# Altium schematic sheet ProximitySensor.SchDoc
size A
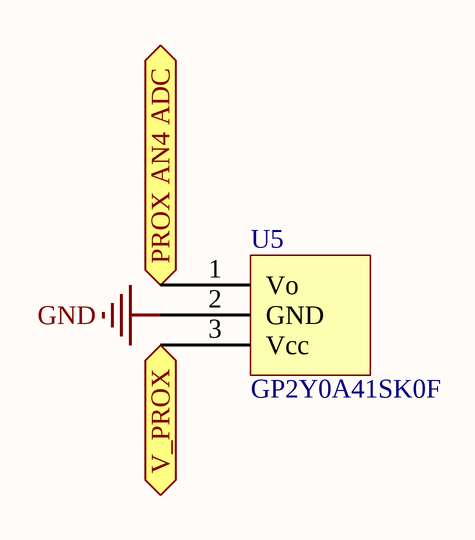
[diagram p0: ProximitySensor.SchDoc]

## Parts
U5  GP2Y0A41SK0F  [Proximity2]

## Ports
PROX AN4 ADC, V_PROX

## Nets
GND: U5.2(GND)
PROX AN4 ADC: U5.1(Vo) ; port PROX AN4 ADC
V_PROX: U5.3(Vcc) ; port V_PROX

## Library data of the parts
U5 = Proximity sensor: Farnell Reference: 1618431